# EAGLE design ps22 (EAGLE 8.6.1)
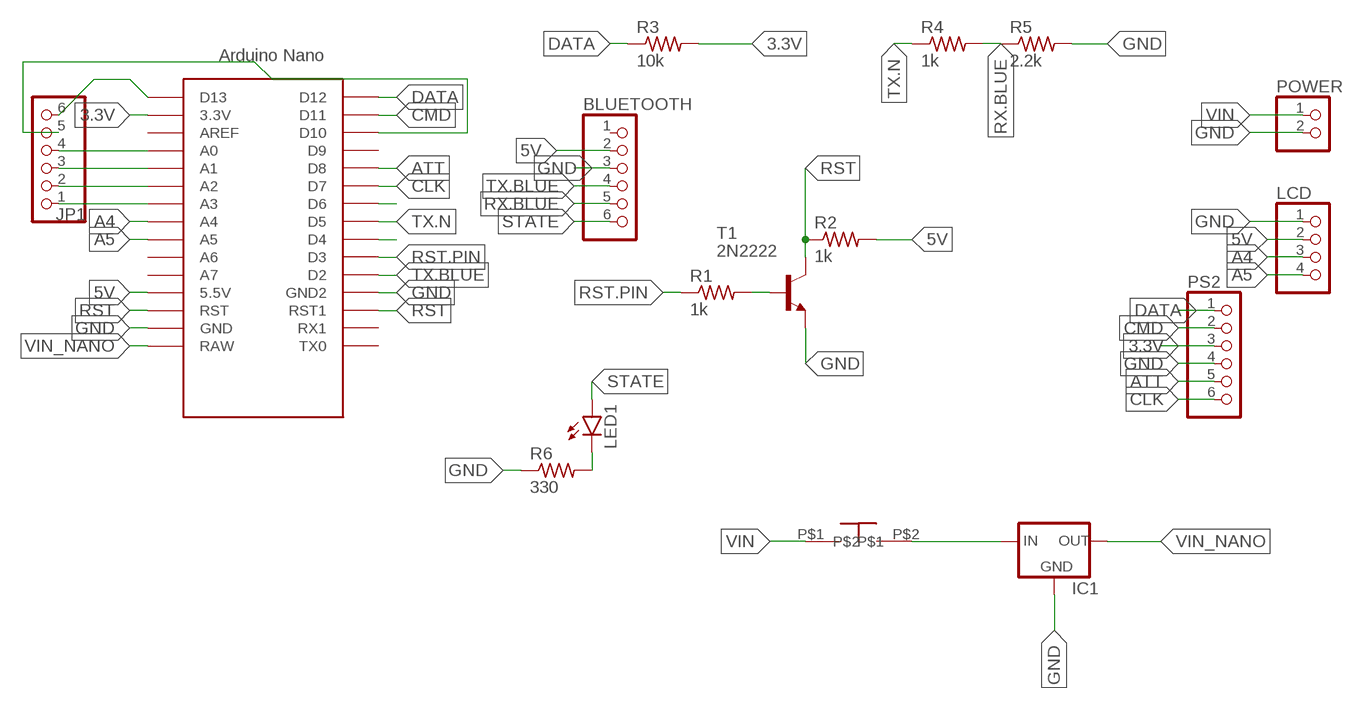
[diagram p0: schematic, sheet 1]

## Parts
BLUETOOTH  PINHD-1X6  [1X06]
IC1  78XXS  [78XXS]
JP1  PINHD-1X6  [1X06]
LCD  PINHD-1X4  [1X04]
LED1  LED3MM  [LED3MM]
POWER  PINHD-1X2  [1X02]
PS2  PINHD-1X6  [1X06]
R1  1k  R-US_0204/5  [0204/5]
R2  1k  R-US_0204/5  [0204/5]
R3  10k  R-US_0204/5  [0204/5]
R4  1k  R-US_0204/5  [0204/5]
R5  2.2k  R-US_0204/5  [0204/5]
R6  330  R-US_0204/5  [0204/5]
T1  2N2222  [TO18]
U$1  NANO  [NANO]
U$2  ON_OFF  [ON_OFF]

## Nets
3.3V: PS2.3 R3.2 U$1.3.3V
5V: BLUETOOTH.2 LCD.2 R2.2 U$1.5V(5.5V)
A4: LCD.3 U$1.A4
A5: LCD.4 U$1.A5
ATT: PS2.5 U$1.D8
CLK: PS2.6 U$1.D7
CMD: PS2.2 U$1.D11
DATA: PS2.1 R3.1 U$1.D12
GND: BLUETOOTH.3 IC1.GND LCD.1 POWER.2 PS2.4 R5.2 R6.1 T1.1(E) U$1.GND U$1.GND1(GND2)
N$1: R1.2 T1.2(B)
N$2: JP1.1 U$1.A3
N$3: LED1.K(C) R6.2
N$4: JP1.2 U$1.A2
N$5: JP1.3 U$1.A1
N$6: JP1.4 U$1.A0
N$7: JP1.6 U$1.D13
N$8: JP1.5 U$1.D10
N$9: IC1.IN U$2.P$2
N$12: U$1.D6
N$14: U$1.D4
RST: R2.1 T1.3(C) U$1.RST U$1.RST1
RST.PIN: R1.1 U$1.D3
RX.BLUE: BLUETOOTH.5 R4.2 R5.1
STATE: BLUETOOTH.6 LED1.A
TX.BLUE: BLUETOOTH.4 U$1.D2
TX.N: R4.1 U$1.D5
VIN: POWER.1 U$2.P$1
VIN_NANO: IC1.OUT U$1.RAW
Unconnected: BLUETOOTH.1 U$1.A6 U$1.A7 U$1.AREF U$1.D9 U$1.RX1 U$1.TX0

## Library data of the parts
BLUETOOTH JP1 PS2 = pinhead:PINHD-1X6: PIN HEADER
IC1 = v-reg:78XXS: VOLTAGE REGULATOR
LCD = pinhead:PINHD-1X4: PIN HEADER
LED1 = led:LED: LED OSRAM: - CHIPLED LG R971, LG N971, LY N971, LG Q971, LY Q971, LO R971, LY R971 LH N974, LH R974 LS Q976, LO Q976, LY Q976 LO Q996 - Hyper CHIPLED LW Q18S LB Q993, LB Q99A, LB R99A - SideLED LS A670, LO A670, LY A670, LG A670, LP A670 LB A673, LV A673, LT A673, LW A673 LH A674 LY A675 LS A676, LA A676, LO A676, LY A676, LW A676 LS A679, LY A679, LG A679 - Hyper Micro SIDELED® LS Y876, LA Y876, LO Y876, LY Y876 LT Y87S - SmartLED LW L88C, LW L88S LB L89C, LB L89S, LG L890 LS L89K, LO L89K, LY L89K LS L896, LA L896, LO L896, LY L896 - TOPLED LS T670, LO T670, LY T670, LG T670, LP T670 LSG T670, LSP T670, LSY T670, LOP T670, LYG T670 LG T671, LOG T671, LSG T671 LB T673, LV T673, LT T673, LW T673 LH T674 LS T676, LA T676, LO T676, LY T676, LB T676, LH T676, LSB T676, LW T676 LB T67C, LV T67C, LT T67C, LS T67K, LO T67K, LY T67K, LW E67C LS E67B, LA E67B, LO E67B, LY E67B, LB E67C, LV E67C, LT E67C LW T67C LS T679, LY T679, LG T679 LS T770, LO T770, LY T770, LG T770, LP T770 LB T773, LV T773, LT T773, LW T773 LH T774 LS E675, LA E675, LY E675, LS T675 LS T776, LA T776, LO T776, LY T776, LB T776 LHGB T686 LT T68C, LB T68C - Hyper Mini TOPLED® LB M676 - Mini TOPLED Santana® LG M470 LS M47K, LO M47K, LY M47K Source: http://www.osram.convergy.de LUXEON: - LUMILED® LXK2-PW12-R00, LXK2-PW12-S00, LXK2-PW14-U00, LXK2-PW14-V00 LXK2-PM12-R00, LXK2-PM12-S00, LXK2-PM14-U00 LXK2-PE12-Q00, LXK2-PE12-R00, LXK2-PE12-S00, LXK2-PE14-T00, LXK2-PE14-U00 LXK2-PB12-K00, LXK2-PB12-L00, LXK2-PB12-M00, LXK2-PB14-N00, LXK2-PB14-P00, LXK2-PB14-Q00 LXK2-PR12-L00, LXK2-PR12-M00, LXK2-PR14-Q00, LXK2-PR14-R00 LXK2-PD12-Q00, LXK2-PD12-R00, LXK2-PD12-S00 LXK2-PH12-R00, LXK2-PH12-S00 LXK2-PL12-P00, LXK2-PL12-Q00, LXK2-PL12-R00 Source: www.luxeon.com KINGBRIGHT: KA-3528ASYC Source: www.kingbright.com
POWER = pinhead:PINHD-1X2: PIN HEADER
R1-R6 = rcl:R-US_: RESISTOR, American symbol; SPICEPREFIX: R
T1 = transistor:2N2222: NPN TRANSISTOR
U$1 = Arduino-clone:NANO: Arduino Nano
U$2 = ON_OFF:ON_OFF

## Board
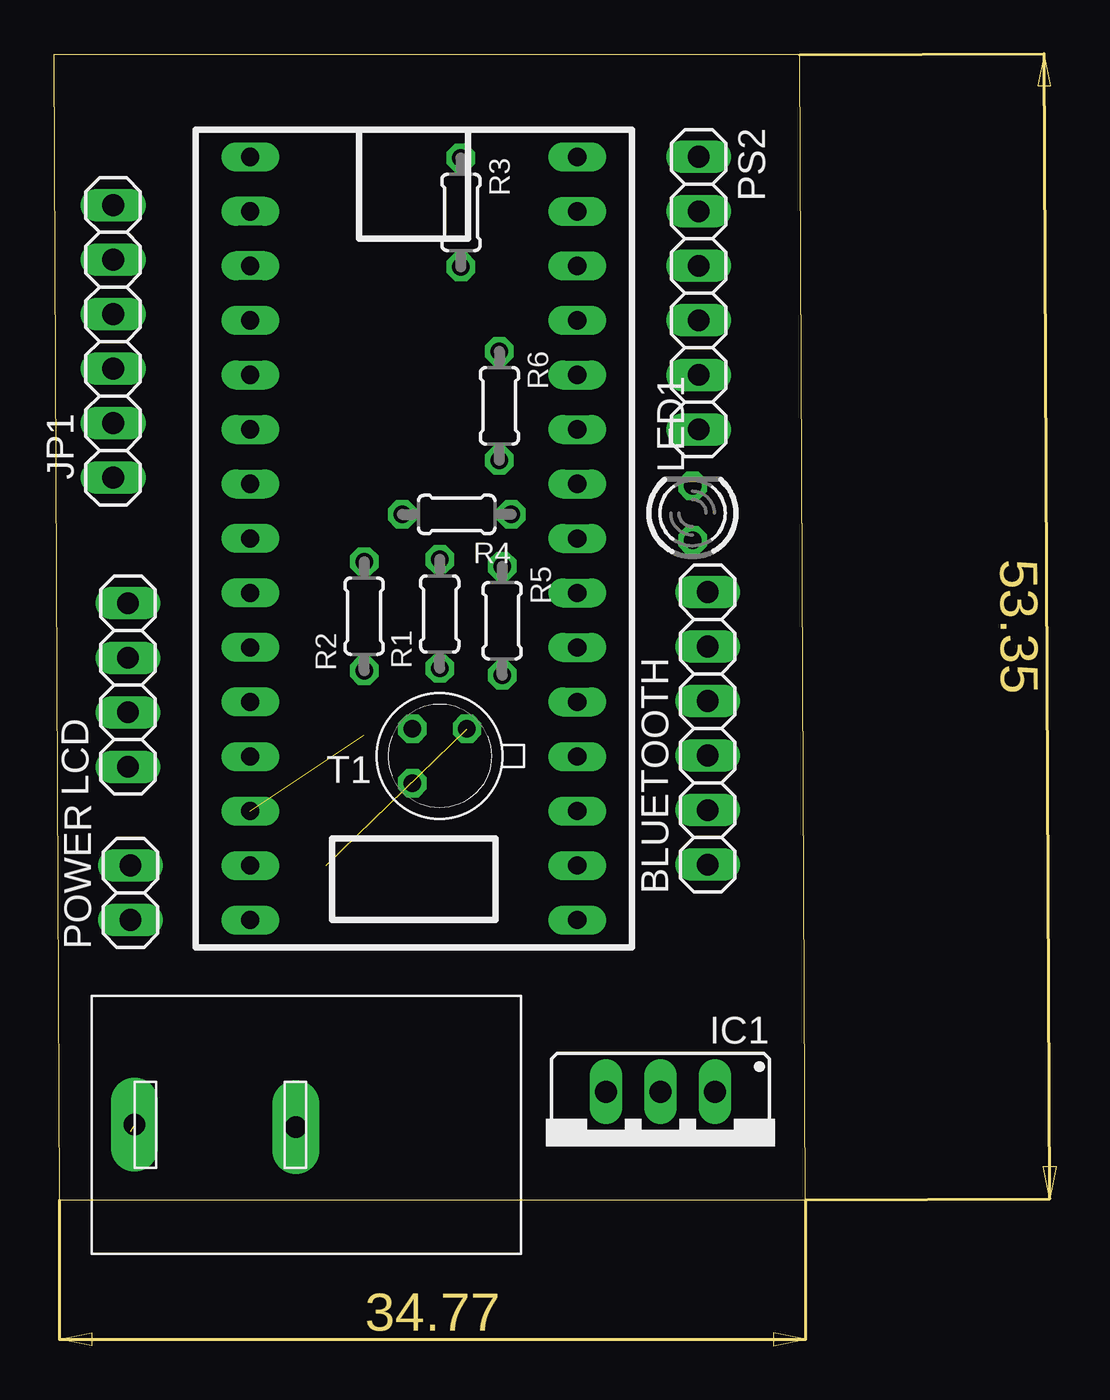
[diagram p1: board, top side]
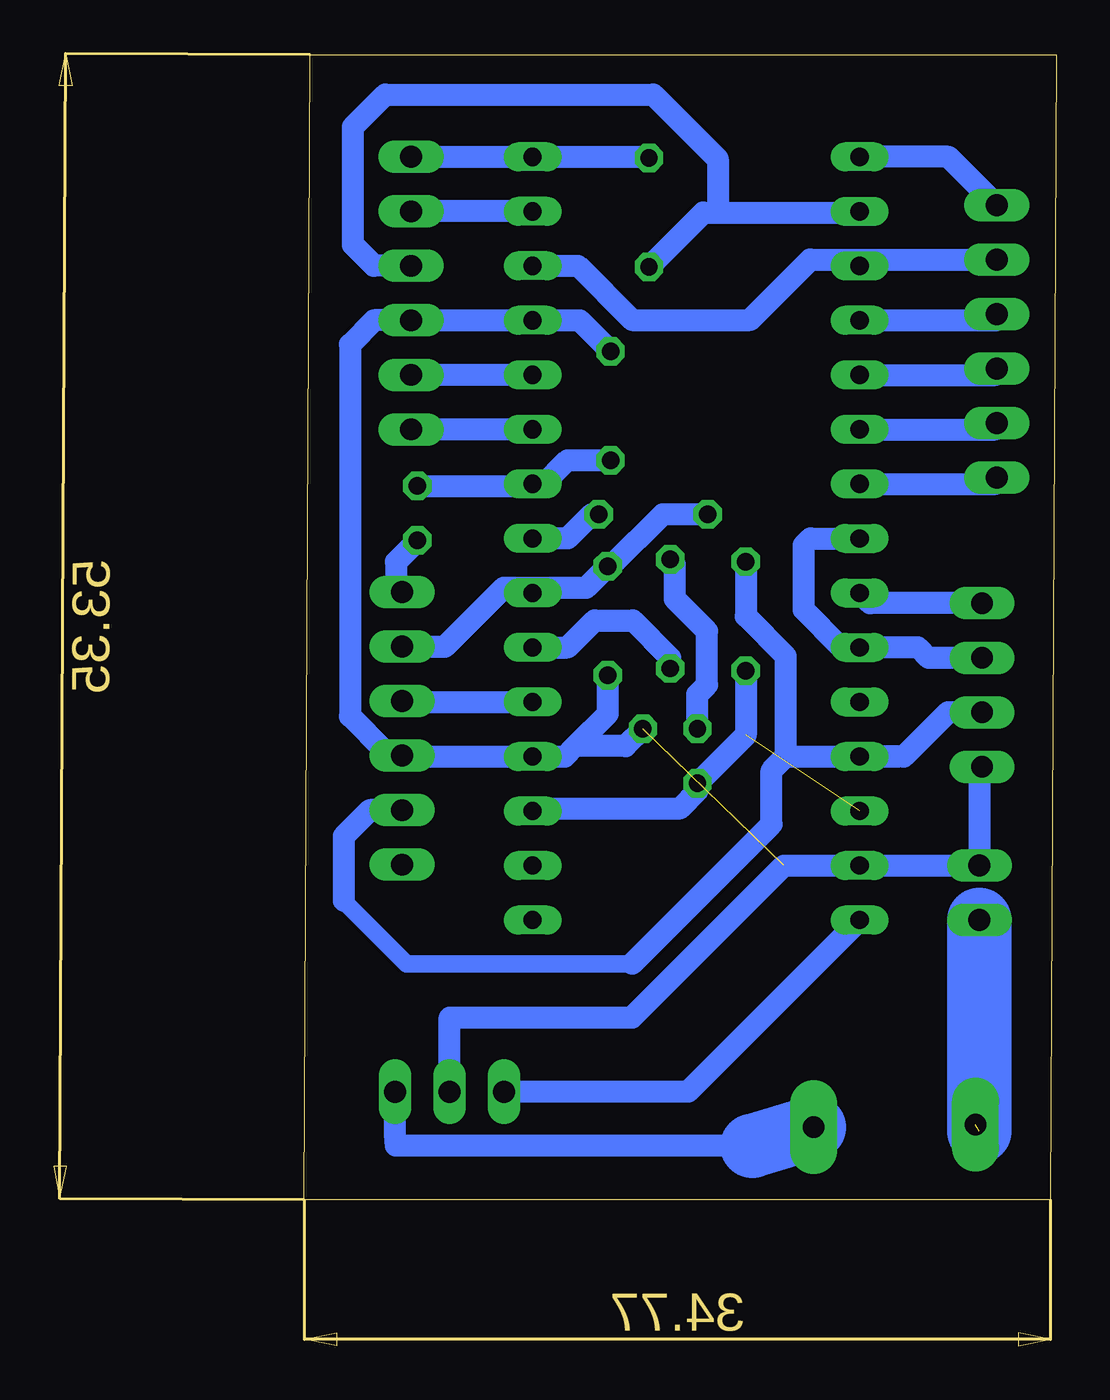
[diagram p2: board, bottom side, seen from below]

Size 35.04 x 53.35 mm. Coordinates in mm from the lower left corner, seen from the top.
Outline: 0.27,0 35.04,0 34.77,53.35 0,53.35 0.27,0
Copper layers (1*16): Top 0.035mm / dielectric 1.5mm / Bottom 0.035mm
Design rules "default": minimum track width 6mil, minimum drill 0.35mm, track to track 6mil, track to pad 6mil, pad to pad 6mil, via to via 6mil, smd to smd 6mil, copper to edge 40mil, drill to drill 6mil, minimum pad ring 10mil, minimum via ring 8mil, stop-mask expansion 4mil, vias tented up to drill 0mil, thermal gap 10mil

### Footprints (pad centres in the part's own frame; a part is rotated, then mirrored left to right if it is on the bottom)
1X06 = drill 1.016 long: 1 -6.35,0; 2 -3.81,0; 3 -1.27,0; 4 1.27,0; 5 3.81,0; 6 6.35,0
78XXS = drill 1.016 long: GND 0,-2.54; IN -2.54,-2.54; OUT 2.54,-2.54
1X04 = drill 1.016 long: 1 -3.81,0; 2 -1.27,0; 3 1.27,0; 4 3.81,0
LED3MM = drill 0.813 octagon: A -1.27,0; K 1.27,0
1X02 = drill 1.016 long: 1 -1.27,0; 2 1.27,0
0204/5 = drill 0.813 octagon: 1 -2.54,0; 2 2.54,0
TO18 = drill 0.813 octagon: 1 -1.27,-1.27; 2 1.27,-1.27; 3 1.27,1.27
NANO = drill 0.85 long: 3.3V -10.16,24.13; 5V -10.16,-1.27; A0 -10.16,19.05; A1 -10.16,16.51; A2 -10.16,13.97; A3 -10.16,11.43; A4 -10.16,8.89; A5 -10.16,6.35; A6 -10.16,3.81; A7 -10.16,1.27; AREF -10.16,21.59; D2 5.08,1.27; D3 5.08,3.81; D4 5.08,6.35; D5 5.08,8.89; D6 5.08,11.43; D7 5.08,13.97; D8 5.08,16.51; D9 5.08,19.05; D10 5.08,21.59; D11 5.08,24.13; D12 5.08,26.67; D13 -10.16,26.67; GND -10.16,-6.35; GND1 5.08,-1.27; RAW -10.16,-8.89; RST -10.16,-3.81; RST1 5.08,-3.81; RX1 5.08,-6.35; TX0 5.08,-8.89
ON_OFF = drill 1 pad 2.184 long: P$1 2,9; P$2 9.525,8.89

### Placement (x,y rotation side)
BLUETOOTH  30.48,21.97 90 top
IC1  28.27,2.5 180 top
JP1  2.77,40 90 top
LCD  3.46,23.99 90 top
LED1  29.77,32 90 top
POWER  3.58,14.31 90 top
PS2  30.06,42.25 270 top
R1  17.99,27.3 90 top
R2  14.47,27.2 90 top
R3  18.98,46.01 270 top
R4  18.78,31.94 180 top
R5  20.9,26.99 270 top
R6  20.77,37 270 top
T1  17.99,20.68 180 top
U$1  19.32,21.93 0 top
U$2  1.77,-5.5 0 top

### Tracks (layer width: path | path; a pad name or v marks a point on that pad's centre or on a via)
3.3V
  Bottom 1.016: R3.2 16.45,46 15.77,46 | U$1.3.3V 9.22,46 15.77,46 | PS2.3 31.79,43.52 32.77,44.5 32.77,50 31.27,51.5 18.77,51.5 15.77,48.5 15.77,46
5V
  Bottom 0.813: 33.21,13.94 30.27,11 19.77,11
  Bottom 1.016: LCD.2 5.05,22.72 7.11,20.66 U$1.5V | BLUETOOTH.2 31.98,18.16 33.21,16.93 33.21,13.94 | U$1.5V 7.39,20.66 | 12.61,20.66 U$1.5V | 12.61,20.66 13.27,20 13.27,17.5 19.77,11 | R2.2 14.47,27.2 12.61,25.34 12.61,20.66
A4
  Bottom 1.016: LCD.3 5.96,25.26 6.46,25.76 10.03,25.76 11.77,27.5 11.77,30.5 11.45,30.82 U$1.A4
A5
  Bottom 1.016: LCD.4 8.68,27.8 U$1.A5
ATT
  Bottom 1.016: 28.33,38.44 PS2.5 U$1.D8
CLK
  Bottom 1.016: 27.87,35.9 PS2.6 U$1.D7
CMD
  Bottom 1.016: U$1.D11 PS2.2
DATA
  Bottom 1.016: PS2.1 U$1.D12 19.03,48.6 R3.1
GND  (1 unrouted)
  Bottom 1.016: LCD.1 3.58,20.06 POWER.2 U$1.GND 12.69,15.58 19.77,8.5 28.27,8.5 IC1.GND | 22.41,21.14 22.9,20.66 U$1.GND1 30.44,20.66 BLUETOOTH.3 30.7,20.92 31.29,20.92 32.91,22.54 32.91,39.86 31.79,40.98 PS2.4 22.21,40.98 R6.1 | 22.41,21.14 20.9,22.66 R5.2 | T1.1 20.07,21.14 22.41,21.14
N$1
  Bottom 1.016: T1.2 16.72,23.55 16.27,24 16.27,26.5 17.77,28 17.77,29.62 R1.2
N$2
  Bottom 1.016: U$1.A3 2.84,33.36 JP1.1
N$3
  Bottom 1.016: LED1.K 23.96,33.27 22.77,34.46 R6.2
N$4
  Bottom 1.016: U$1.A2 2.84,35.9 JP1.2
N$5
  Bottom 1.016: U$1.A1 2.84,38.44 JP1.3
N$6
  Bottom 1.016: U$1.A0 2.84,40.98 JP1.4
N$7
  Bottom 1.016: JP1.6 5.02,48.6 U$1.D13
N$8
  Bottom 1.016: U$1.D10 22.29,43.52 19.77,41 14.27,41 11.46,43.81 JP1.5
N$9
  Bottom 1.016: 14.16,2.52 30.77,2.52 30.81,3.06 IC1.IN
  Bottom 3: U$2.P$2 14.16,2.52
RST  (1 unrouted)
  Bottom 1.016: U$1.RST1 24.27,18.25 17.52,18.25 16.72,19.05 T1.3 14.47,21.66 R2.1
RST.PIN
  Bottom 1.016: R1.1 17.99,25.26 19.73,27 21.51,27 22.77,25.74 U$1.D3
RX.BLUE
  Bottom 1.016: 30.29,25.97 BLUETOOTH.5 28.49,25.78 25.74,28.53 21.9,28.53 R5.1 20.74,29.53 18.33,31.94 R4.2
STATE
  Bottom 1.016: LED1.A 30.77,29.73 30.77,28.61 BLUETOOTH.6
TX.BLUE
  Bottom 1.016: BLUETOOTH.4 30.44,23.2 U$1.D2
TX.N
  Bottom 1.016: U$1.D5 22.77,30.82 21.65,31.94 R4.1
VIN  (1 unrouted)
  Bottom 1.016: 3.58,3.19 3.77,3 3.77,2.5
  Bottom 3: POWER.1 3.58,3.19
VIN_NANO
  Bottom 1.016: U$1.RAW 17.16,5.04 IC1.OUT